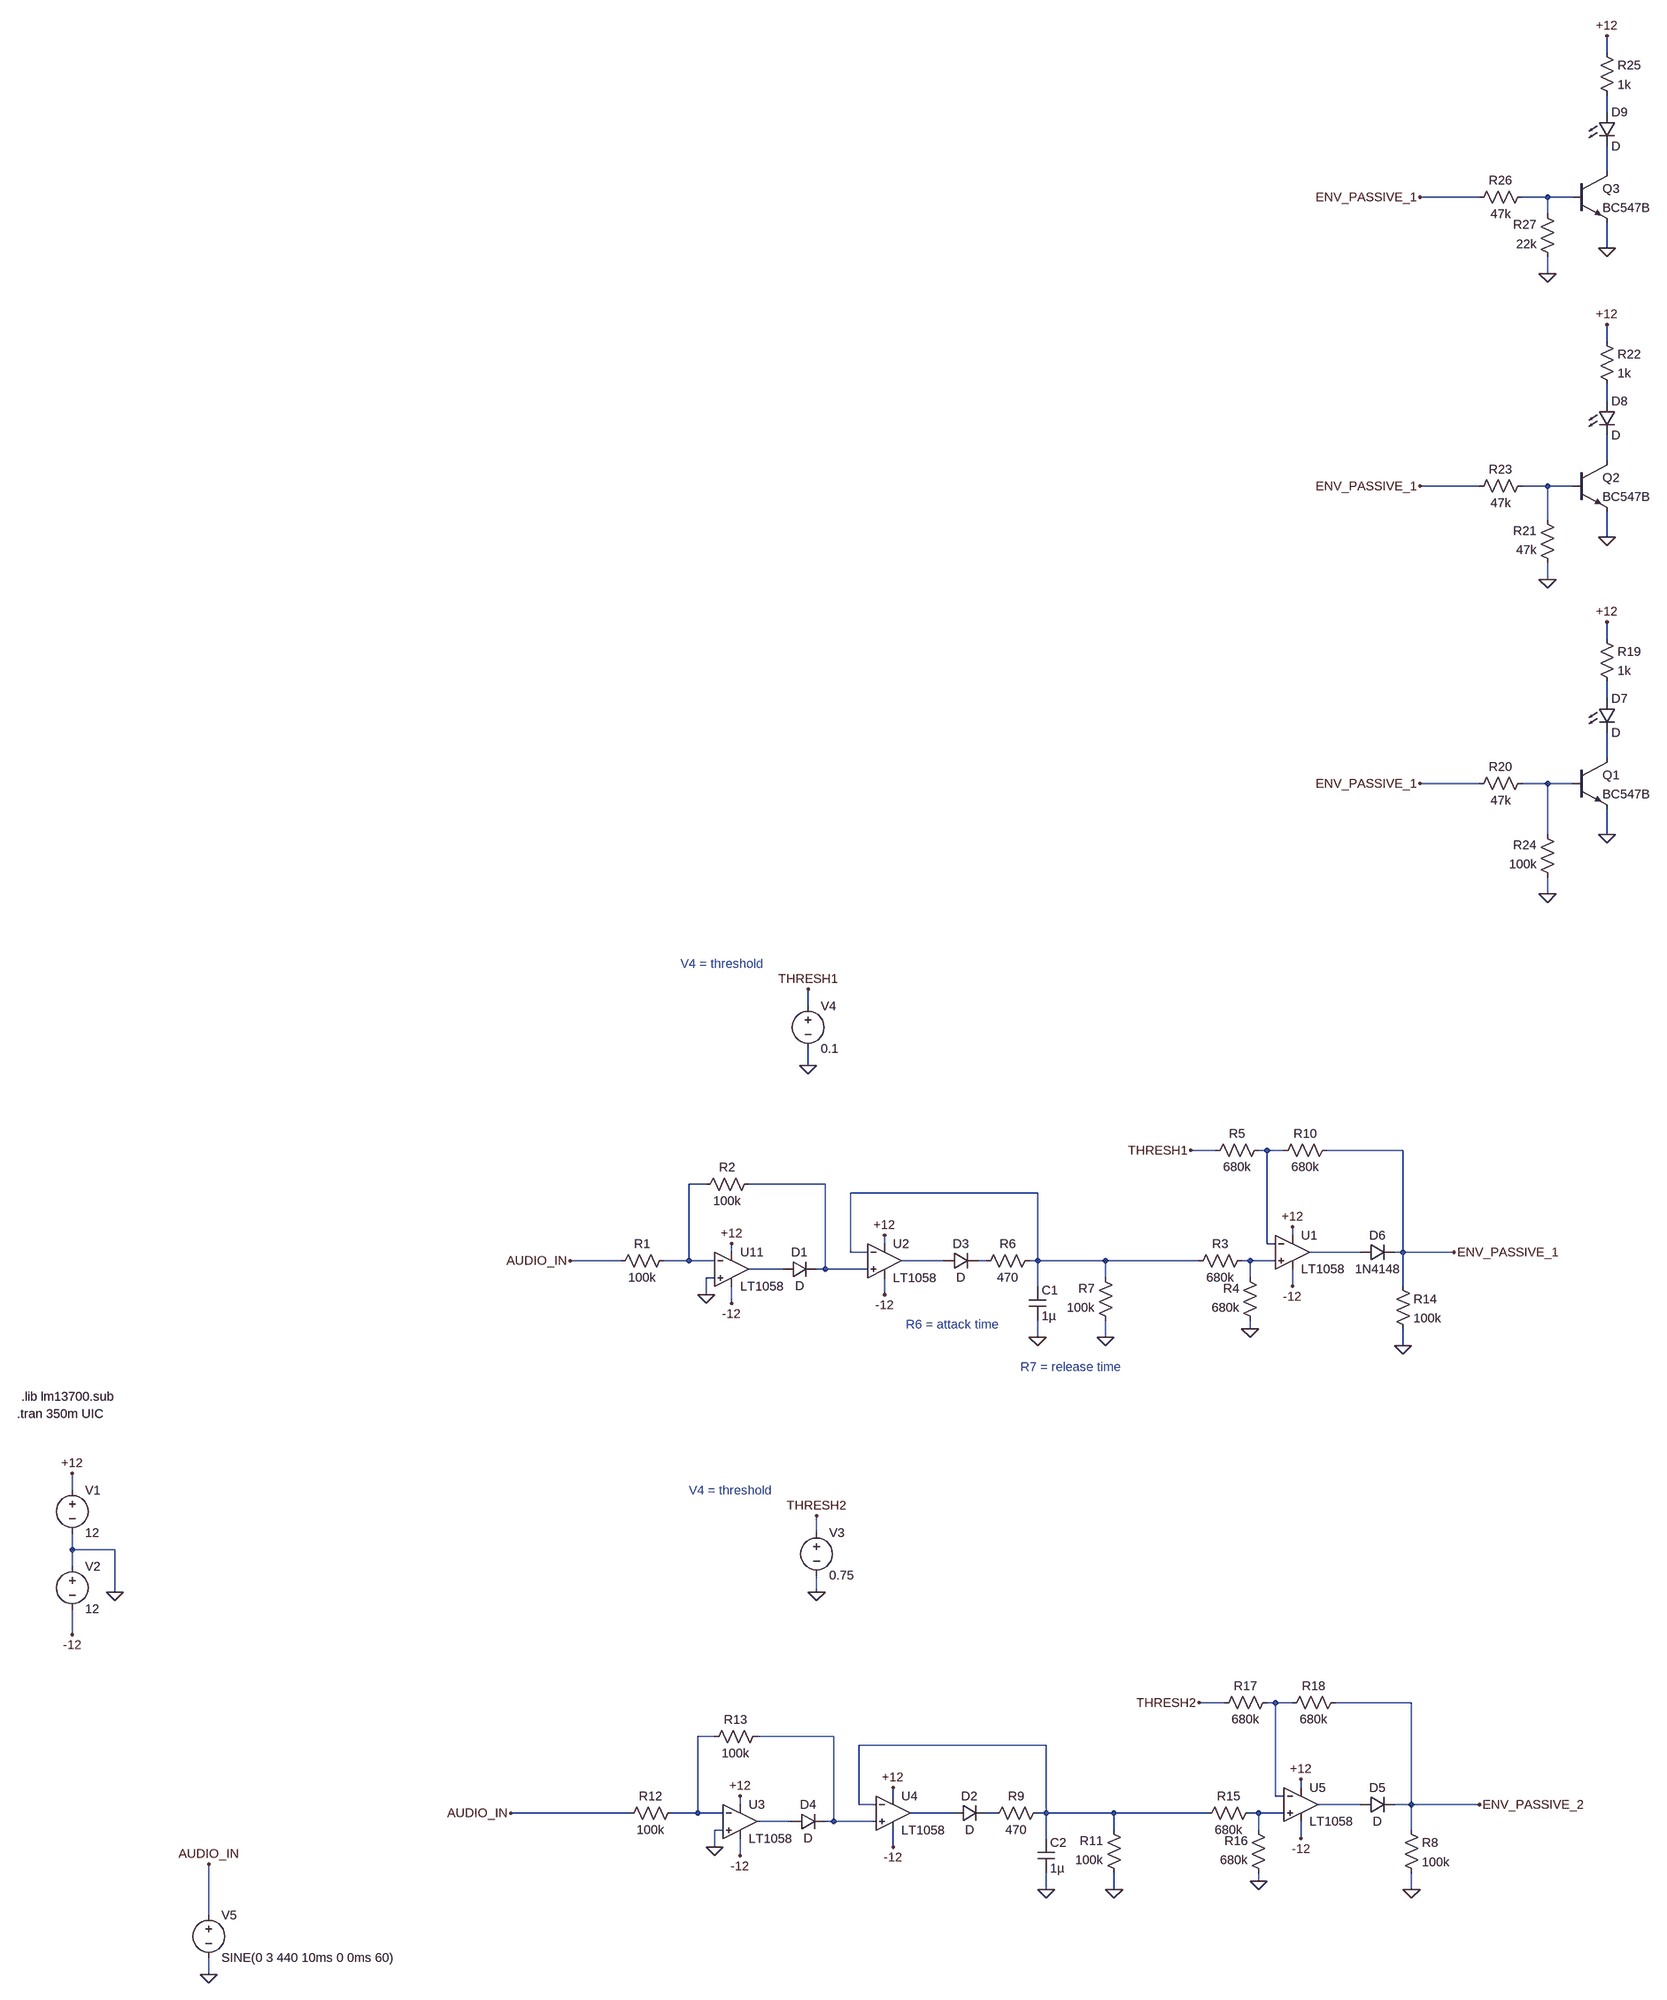
[diagram p0: schematic EnvFollowerSim.asc]
EnvFollowerSim.asc, the LTspice schematic file:
Version 4
SHEET 1 6452 3692
WIRE 3600 -2544 3600 -2576
WIRE 3600 -2432 3600 -2464
WIRE 3600 -2320 3600 -2368
WIRE 3360 -2272 3248 -2272
WIRE 3488 -2272 3440 -2272
WIRE 3536 -2272 3488 -2272
WIRE 3488 -2240 3488 -2272
WIRE 3600 -2176 3600 -2224
WIRE 3488 -2128 3488 -2160
WIRE 3600 -2000 3600 -2032
WIRE 3600 -1888 3600 -1920
WIRE 3600 -1776 3600 -1824
WIRE 3360 -1728 3248 -1728
WIRE 3488 -1728 3440 -1728
WIRE 3536 -1728 3488 -1728
WIRE 3488 -1664 3488 -1728
WIRE 3600 -1632 3600 -1680
WIRE 3488 -1552 3488 -1584
WIRE 3600 -1440 3600 -1472
WIRE 3600 -1328 3600 -1360
WIRE 3600 -1216 3600 -1264
WIRE 3360 -1168 3248 -1168
WIRE 3488 -1168 3440 -1168
WIRE 3536 -1168 3488 -1168
WIRE 3488 -1072 3488 -1168
WIRE 3600 -1072 3600 -1120
WIRE 3488 -960 3488 -992
WIRE 2096 -704 2096 -736
WIRE 2096 -592 2096 -624
WIRE 2864 -384 2816 -384
WIRE 2960 -384 2944 -384
WIRE 2992 -384 2960 -384
WIRE 3216 -384 3072 -384
WIRE 1904 -320 1872 -320
WIRE 2128 -320 1984 -320
WIRE 2528 -304 2176 -304
WIRE 3008 -224 3008 -240
WIRE 2240 -208 2240 -224
WIRE 2960 -208 2960 -384
WIRE 2976 -208 2960 -208
WIRE 1952 -192 1952 -208
WIRE 2176 -192 2176 -304
WIRE 2208 -192 2176 -192
WIRE 3136 -192 3040 -192
WIRE 3216 -192 3216 -384
WIRE 3216 -192 3200 -192
WIRE 3312 -192 3216 -192
WIRE 1744 -176 1648 -176
WIRE 1872 -176 1872 -320
WIRE 1872 -176 1824 -176
WIRE 1920 -176 1872 -176
WIRE 2352 -176 2272 -176
WIRE 2432 -176 2416 -176
WIRE 2528 -176 2528 -304
WIRE 2528 -176 2512 -176
WIRE 2656 -176 2528 -176
WIRE 2832 -176 2656 -176
WIRE 2928 -176 2912 -176
WIRE 2976 -176 2928 -176
WIRE 2048 -160 1984 -160
WIRE 2128 -160 2128 -320
WIRE 2128 -160 2112 -160
WIRE 2208 -160 2128 -160
WIRE 1920 -144 1904 -144
WIRE 2656 -144 2656 -176
WIRE 2928 -144 2928 -176
WIRE 2528 -128 2528 -176
WIRE 3008 -128 3008 -160
WIRE 3216 -128 3216 -192
WIRE 1904 -112 1904 -144
WIRE 2240 -112 2240 -144
WIRE 1952 -96 1952 -128
WIRE 2928 -48 2928 -64
WIRE 2528 -32 2528 -64
WIRE 2656 -32 2656 -64
WIRE 3216 -16 3216 -48
WIRE 64 256 64 224
WIRE 2112 336 2112 304
WIRE 64 368 64 336
WIRE 144 368 64 368
WIRE 64 400 64 368
WIRE 144 448 144 368
WIRE 2112 448 2112 416
WIRE 64 528 64 480
WIRE 2880 656 2832 656
WIRE 2976 656 2960 656
WIRE 3008 656 2976 656
WIRE 3232 656 3088 656
WIRE 1920 720 1888 720
WIRE 2144 720 2000 720
WIRE 2544 736 2192 736
WIRE 3024 816 3024 800
WIRE 2256 832 2256 816
WIRE 2976 832 2976 656
WIRE 2992 832 2976 832
WIRE 1968 848 1968 832
WIRE 2192 848 2192 736
WIRE 2224 848 2192 848
WIRE 3136 848 3056 848
WIRE 3232 848 3232 656
WIRE 3232 848 3200 848
WIRE 3360 848 3232 848
WIRE 1760 864 1536 864
WIRE 1888 864 1888 720
WIRE 1888 864 1840 864
WIRE 1936 864 1888 864
WIRE 2368 864 2288 864
WIRE 2448 864 2432 864
WIRE 2544 864 2544 736
WIRE 2544 864 2528 864
WIRE 2672 864 2544 864
WIRE 2848 864 2672 864
WIRE 2944 864 2928 864
WIRE 2992 864 2944 864
WIRE 2064 880 2000 880
WIRE 2144 880 2144 720
WIRE 2144 880 2128 880
WIRE 2224 880 2144 880
WIRE 1936 896 1920 896
WIRE 2672 896 2672 864
WIRE 2944 896 2944 864
WIRE 3232 896 3232 848
WIRE 2544 912 2544 864
WIRE 3024 912 3024 880
WIRE 1920 928 1920 896
WIRE 2256 928 2256 896
WIRE 1968 944 1968 912
WIRE 2944 992 2944 976
WIRE 2544 1008 2544 976
WIRE 2672 1008 2672 976
WIRE 3232 1008 3232 976
WIRE 416 1056 416 960
WIRE 416 1168 416 1136
FLAG 64 224 +12
FLAG 64 528 -12
FLAG 144 448 0
FLAG 1952 -208 +12
FLAG 1952 -96 -12
FLAG 1904 -112 0
FLAG 416 1168 0
FLAG 416 960 AUDIO_IN
FLAG 1648 -176 AUDIO_IN
FLAG 2240 -224 +12
FLAG 2240 -112 -12
FLAG 2528 -32 0
FLAG 2656 -32 0
FLAG 2096 -592 0
FLAG 2096 -736 THRESH1
FLAG 3008 -240 +12
FLAG 3008 -128 -12
FLAG 2928 -48 0
FLAG 2816 -384 THRESH1
FLAG 3312 -192 ENV_PASSIVE_1
FLAG 1968 832 +12
FLAG 1968 944 -12
FLAG 1920 928 0
FLAG 1536 864 AUDIO_IN
FLAG 2256 816 +12
FLAG 2256 928 -12
FLAG 2544 1008 0
FLAG 2672 1008 0
FLAG 2112 448 0
FLAG 2112 304 THRESH2
FLAG 3024 800 +12
FLAG 3024 912 -12
FLAG 2944 992 0
FLAG 2832 656 THRESH2
FLAG 3360 848 ENV_PASSIVE_2
FLAG 3232 1008 0
FLAG 3216 -16 0
FLAG 3600 -1472 +12
FLAG 3600 -1072 0
FLAG 3248 -1168 ENV_PASSIVE_1
FLAG 3600 -2032 +12
FLAG 3600 -1632 0
FLAG 3248 -1728 ENV_PASSIVE_1
FLAG 3600 -2576 +12
FLAG 3600 -2176 0
FLAG 3488 -2128 0
FLAG 3248 -2272 ENV_PASSIVE_1
FLAG 3488 -1552 0
FLAG 3488 -960 0
SYMBOL voltage 64 240 R0
SYMATTR InstName V1
SYMATTR Value 12
SYMBOL voltage 64 384 R0
SYMATTR InstName V2
SYMATTR Value 12
SYMBOL OpAmps/LT1058 1952 -224 R0
SYMATTR InstName U11
SYMBOL voltage 416 1040 R0
SYMATTR InstName V5
SYMATTR Value SINE(0 3 440 10ms 0 0ms 60)
SYMBOL OpAmps/LT1058 2240 -240 R0
SYMATTR InstName U2
SYMBOL diode 2352 -160 R270
WINDOW 0 32 32 VTop 2
WINDOW 3 0 32 VBottom 2
SYMATTR InstName D3
SYMBOL res 2528 -192 R90
WINDOW 0 0 56 VBottom 2
WINDOW 3 32 56 VTop 2
SYMATTR InstName R6
SYMATTR Value 470
SYMBOL cap 2512 -128 R0
SYMATTR InstName C1
SYMATTR Value 1µ
SYMBOL res 2672 -48 R180
WINDOW 0 36 76 Left 2
WINDOW 3 36 40 Left 2
SYMATTR InstName R7
SYMATTR Value 100k
SYMBOL voltage 2096 -720 R0
SYMATTR InstName V4
SYMATTR Value 0.1
SYMBOL res 1840 -192 R90
WINDOW 0 0 56 VBottom 2
WINDOW 3 32 56 VTop 2
SYMATTR InstName R1
SYMATTR Value 100k
SYMBOL res 2000 -336 R90
WINDOW 0 0 56 VBottom 2
WINDOW 3 32 56 VTop 2
SYMATTR InstName R2
SYMATTR Value 100k
SYMBOL diode 2048 -144 R270
WINDOW 0 32 32 VTop 2
WINDOW 3 0 32 VBottom 2
SYMATTR InstName D1
SYMBOL OpAmps/LT1058 3008 -256 R0
SYMATTR InstName U1
SYMBOL res 2928 -192 R90
WINDOW 0 0 56 VBottom 2
WINDOW 3 32 56 VTop 2
SYMATTR InstName R3
SYMATTR Value 680k
SYMBOL res 2944 -48 R180
WINDOW 0 36 76 Left 2
WINDOW 3 36 40 Left 2
SYMATTR InstName R4
SYMATTR Value 680k
SYMBOL res 2848 -368 R270
WINDOW 0 32 56 VTop 2
WINDOW 3 0 56 VBottom 2
SYMATTR InstName R5
SYMATTR Value 680k
SYMBOL res 2976 -368 R270
WINDOW 0 32 56 VTop 2
WINDOW 3 0 56 VBottom 2
SYMATTR InstName R10
SYMATTR Value 680k
SYMBOL OpAmps/LT1058 1968 816 R0
SYMATTR InstName U3
SYMBOL OpAmps/LT1058 2256 800 R0
SYMATTR InstName U4
SYMBOL diode 2368 880 R270
WINDOW 0 32 32 VTop 2
WINDOW 3 0 32 VBottom 2
SYMATTR InstName D2
SYMBOL res 2544 848 R90
WINDOW 0 0 56 VBottom 2
WINDOW 3 32 56 VTop 2
SYMATTR InstName R9
SYMATTR Value 470
SYMBOL cap 2528 912 R0
SYMATTR InstName C2
SYMATTR Value 1µ
SYMBOL res 2688 992 R180
WINDOW 0 36 76 Left 2
WINDOW 3 36 40 Left 2
SYMATTR InstName R11
SYMATTR Value 100k
SYMBOL voltage 2112 320 R0
SYMATTR InstName V3
SYMATTR Value 0.75
SYMBOL res 1856 848 R90
WINDOW 0 0 56 VBottom 2
WINDOW 3 32 56 VTop 2
SYMATTR InstName R12
SYMATTR Value 100k
SYMBOL res 2016 704 R90
WINDOW 0 0 56 VBottom 2
WINDOW 3 32 56 VTop 2
SYMATTR InstName R13
SYMATTR Value 100k
SYMBOL diode 2064 896 R270
WINDOW 0 32 32 VTop 2
WINDOW 3 0 32 VBottom 2
SYMATTR InstName D4
SYMBOL OpAmps/LT1058 3024 784 R0
SYMATTR InstName U5
SYMBOL res 2944 848 R90
WINDOW 0 0 56 VBottom 2
WINDOW 3 32 56 VTop 2
SYMATTR InstName R15
SYMATTR Value 680k
SYMBOL res 2960 992 R180
WINDOW 0 36 76 Left 2
WINDOW 3 36 40 Left 2
SYMATTR InstName R16
SYMATTR Value 680k
SYMBOL res 2864 672 R270
WINDOW 0 32 56 VTop 2
WINDOW 3 0 56 VBottom 2
SYMATTR InstName R17
SYMATTR Value 680k
SYMBOL res 2992 672 R270
WINDOW 0 32 56 VTop 2
WINDOW 3 0 56 VBottom 2
SYMATTR InstName R18
SYMATTR Value 680k
SYMBOL diode 3136 -176 R270
WINDOW 0 32 32 VTop 2
WINDOW 3 0 32 VBottom 2
SYMATTR InstName D6
SYMATTR Value 1N4148
SYMBOL res 3216 880 R0
SYMATTR InstName R8
SYMATTR Value 100k
SYMBOL res 3200 -144 R0
SYMATTR InstName R14
SYMATTR Value 100k
SYMBOL npn 3536 -1216 R0
SYMATTR InstName Q1
SYMATTR Value BC547B
SYMBOL LED 3584 -1328 R0
SYMATTR InstName D7
SYMBOL res 3584 -1456 R0
SYMATTR InstName R19
SYMATTR Value 1k
SYMBOL res 3456 -1184 R90
WINDOW 0 0 56 VBottom 2
WINDOW 3 32 56 VTop 2
SYMATTR InstName R20
SYMATTR Value 47k
SYMBOL npn 3536 -1776 R0
SYMATTR InstName Q2
SYMATTR Value BC547B
SYMBOL LED 3584 -1888 R0
SYMATTR InstName D8
SYMBOL res 3584 -2016 R0
SYMATTR InstName R22
SYMATTR Value 1k
SYMBOL res 3456 -1744 R90
WINDOW 0 0 56 VBottom 2
WINDOW 3 32 56 VTop 2
SYMATTR InstName R23
SYMATTR Value 47k
SYMBOL npn 3536 -2320 R0
SYMATTR InstName Q3
SYMATTR Value BC547B
SYMBOL LED 3584 -2432 R0
SYMATTR InstName D9
SYMBOL res 3584 -2560 R0
SYMATTR InstName R25
SYMATTR Value 1k
SYMBOL res 3456 -2288 R90
WINDOW 0 0 56 VBottom 2
WINDOW 3 32 56 VTop 2
SYMATTR InstName R26
SYMATTR Value 47k
SYMBOL res 3504 -2144 R180
WINDOW 0 36 76 Left 2
WINDOW 3 36 40 Left 2
SYMATTR InstName R27
SYMATTR Value 22k
SYMBOL res 3504 -1568 R180
WINDOW 0 36 76 Left 2
WINDOW 3 36 40 Left 2
SYMATTR InstName R21
SYMATTR Value 47k
SYMBOL res 3504 -976 R180
WINDOW 0 36 76 Left 2
WINDOW 3 36 40 Left 2
SYMATTR InstName R24
SYMATTR Value 100k
SYMBOL diode 3136 864 R270
WINDOW 0 32 32 VTop 2
WINDOW 3 0 32 VBottom 2
SYMATTR InstName D5
TEXT -40 112 Left 2 !.tran 350m UIC
TEXT -32 80 Left 2 !.lib lm13700.sub
TEXT 2280 -56 Left 2 ;R6 = attack time
TEXT 2496 24 Left 2 ;R7 = release time
TEXT 1856 -784 Left 2 ;V4 = threshold
TEXT 1872 256 Left 2 ;V4 = threshold

The netlist it stands for:
* EnvFollowerSim.asc
V1 +12 0 12
V2 0 -12 12
XU11 0 N011 +12 -12 N018 LT1057  ; LT1058, pins In+ In- V+ V- OUT
V5 AUDIO_IN 0 SINE(0 3 440 10ms 0 0ms 60)
XU2 N012 N013 +12 -12 N015 LT1057  ; LT1058, pins In+ In- V+ V- OUT
D3 N015 N016 D
R6 N013 N016 470
C1 N013 0 1µ
R7 0 N013 100k
V4 THRESH1 0 0.1
R1 N011 AUDIO_IN 100k
R2 N012 N011 100k
D1 N018 N012 D
XU1 N017 N010 +12 -12 N014 LT1057  ; LT1058, pins In+ In- V+ V- OUT
R3 N017 N013 680k
R4 0 N017 680k
R5 THRESH1 N010 680k
R10 N010 ENV_PASSIVE_1 680k
XU3 0 N020 +12 -12 N027 LT1057  ; LT1058, pins In+ In- V+ V- OUT
XU4 N021 N022 +12 -12 N024 LT1057  ; LT1058, pins In+ In- V+ V- OUT
D2 N024 N025 D
R9 N022 N025 470
C2 N022 0 1µ
R11 0 N022 100k
V3 THRESH2 0 0.75
R12 N020 AUDIO_IN 100k
R13 N021 N020 100k
D4 N027 N021 D
XU5 N026 N019 +12 -12 N023 LT1057  ; LT1058, pins In+ In- V+ V- OUT
R15 N026 N022 680k
R16 0 N026 680k
R17 THRESH2 N019 680k
R18 N019 ENV_PASSIVE_2 680k
D6 N014 ENV_PASSIVE_1 1N4148
R8 ENV_PASSIVE_2 0 100k
R14 ENV_PASSIVE_1 0 100k
Q1 N008 N009 0 0 BC547B
D7 N007 N008 D
R19 +12 N007 1k
R20 N009 ENV_PASSIVE_1 47k
Q2 N005 N006 0 0 BC547B
D8 N004 N005 D
R22 +12 N004 1k
R23 N006 ENV_PASSIVE_1 47k
Q3 N002 N003 0 0 BC547B
D9 N001 N002 D
R25 +12 N001 1k
R26 N003 ENV_PASSIVE_1 47k
R27 0 N003 22k
R21 0 N006 47k
R24 0 N009 100k
D5 N023 ENV_PASSIVE_2 D
.model D D
.lib standard.dio
.model NPN NPN
.model PNP PNP
.lib standard.bjt
.tran 350m UIC
.lib lm13700.sub
* R6 = attack time
* R7 = release time
* V4 = threshold
* V4 = threshold
.lib LTC.lib
.backanno
.end